# Altium schematic sheet MCU.SchDoc
size A3; SheetNumber: 4; SheetTotal: 5
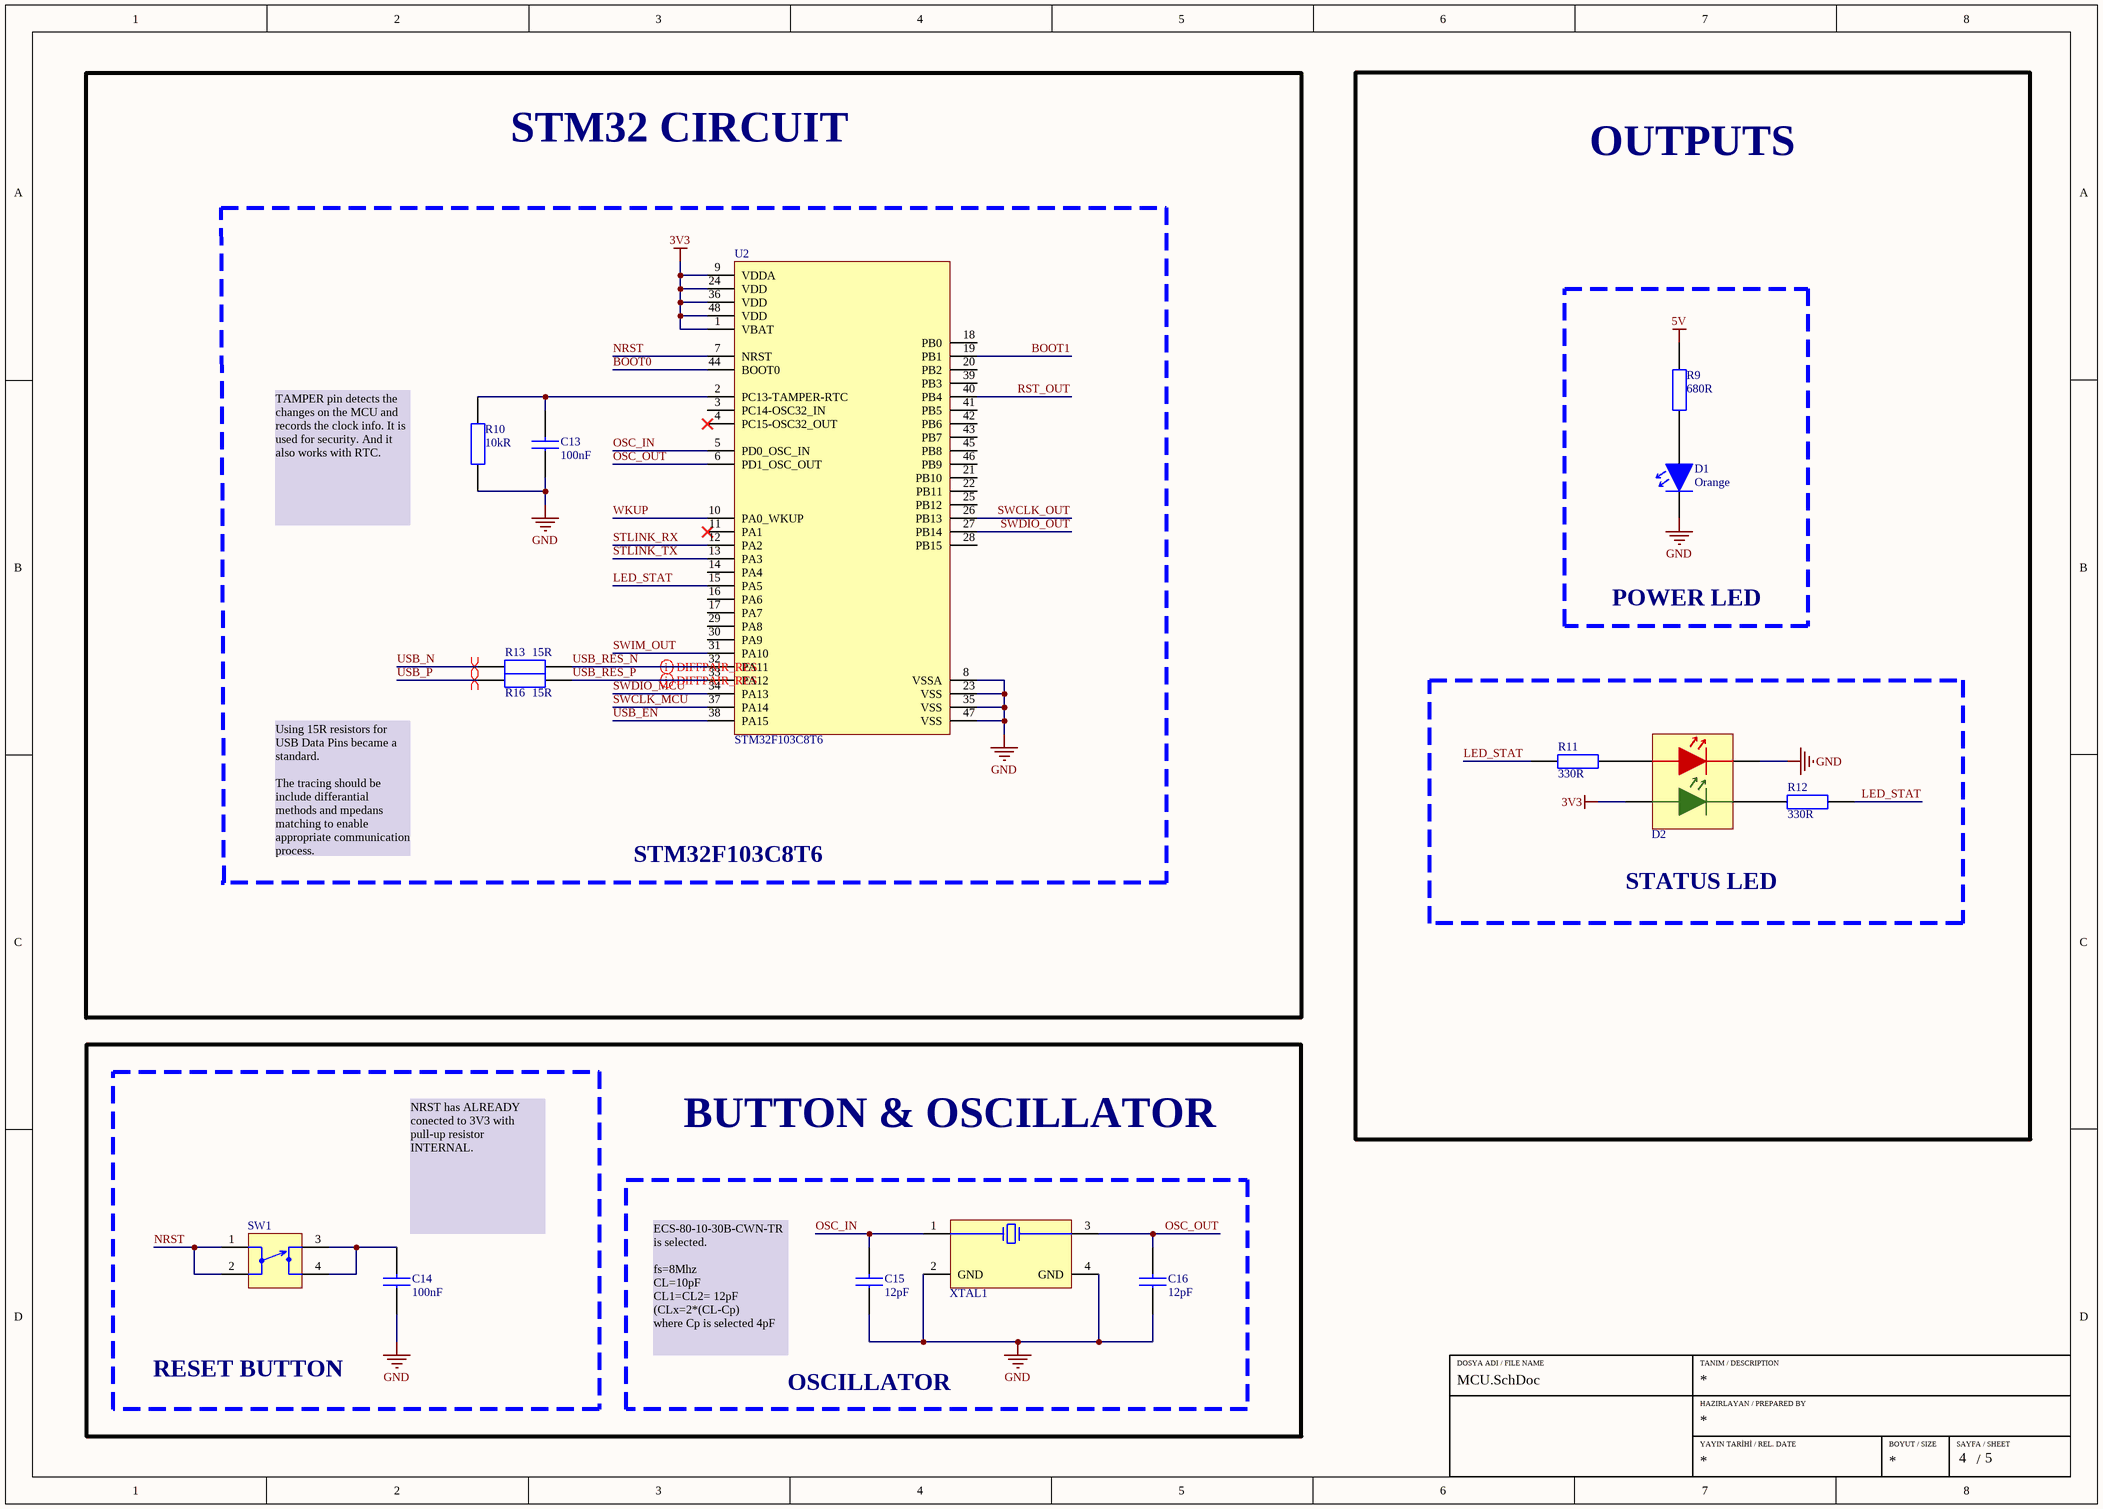
[diagram p0: MCU.SchDoc]

## Parts
C13  Capacitance: 100nF  [CAP_0603]  (hidden comment: C0603C104K5RACTU)
C14  Capacitance: 100nF  [CAP_0603]  (hidden comment: C0603C104K5RACTU)
C15  Capacitance: 12pF  [CAP_0603]  (hidden comment: CC0603FRNPO9BN120)
C16  Capacitance: 12pF  [CAP_0603]  (hidden comment: CC0603FRNPO9BN120)
D1  Illumination Color: Orange  [LED_ORANGE_0805]  (hidden comment: LTST-C170KFKT)
D2  APHB1608CGKSURKC  [LED_INDP_GREENRED_0603]  (value not drawn)
R9  Resistance: 680R  [RES_1206]  (hidden comment: RC1206FR-07680RL)
R10  Resistance: 10kR  [RES_0603]  (hidden comment: RC0603FR-0710KL)
R11  Resistance: 330R  [RES_0603]  (hidden comment: ERJ-H3EF3300V)
R12  Resistance: 330R  [RES_0603]  (hidden comment: ERJ-H3EF3300V)
R13  Resistance: 15R  [RES_0603]  (hidden comment: RC0603JR-0715RL)
R16  Resistance: 15R  [RES_0603]  (hidden comment: RC0603JR-0715RL)
SW1  PTS810 SJG 250 SMTR LFS  [BUTTON_SMD_BLUE]  (value not drawn)
U2  STM32F103C8T6  [LQFP48-STM]
XTAL1  ECS-80-10-30B-CWN-TR  [4-SMD, No Lead]  (value not drawn)

## Blocks framed on the sheet
STM32F103C8T6: C13 R10 R13 R16 U2
POWER LED: D1 R9
STATUS LED: D2 R11 R12
RESET BUTTON: C14 SW1
OSCILLATOR: C15 C16 XTAL1

## Nets
3V3: D2.1 U2.1(VBAT) U2.9(VDDA) U2.24(VDD) U2.36(VDD) U2.48(VDD)
5V: R9.1
GND: C13.1 C14.1 C15.1 C16.1 D1.1 D2.4 R10.1 U2.8(VSSA) U2.23(VSS) U2.35(VSS) U2.47(VSS) XTAL1.2(GND) XTAL1.4(GND)
BOOT0: U2.44(BOOT0)
BOOT1: U2.19(PB1)
LED_STAT: R11.1 R12.2 U2.15(PA5)
NRST: SW1.1 SW1.2 U2.7(NRST)
OSC_IN: C15.2 U2.5(PD0_OSC_IN) XTAL1.1
OSC_OUT: C16.2 U2.6(PD1_OSC_OUT) XTAL1.3
RST_OUT: U2.40(PB4)
STLINK_RX: U2.12(PA2)
STLINK_TX: U2.13(PA3)
SWCLK_MCU: U2.37(PA14)
SWCLK_OUT: U2.26(PB13)
SWDIO_MCU: U2.34(PA13)
SWDIO_OUT: U2.27(PB14)
SWIM_OUT: U2.31(PA10)
USB_EN: U2.38(PA15)
USB_N: R13.1
USB_P: R16.1
USB_RES_N: R13.2 U2.32(PA11)
USB_RES_P: R16.2 U2.33(PA12)
WKUP: U2.10(PA0_WKUP)
NetC13_2: C13.2 R10.2 U2.2(PC13-TAMPER-RTC)
NetC14_2: C14.2 SW1.3 SW1.4
NetD1_2: D1.2 R9.2
NetD2_2: D2.2 R12.1
NetD2_3: D2.3 R11.2

Not connected (* = marked no-connect by the designer): U2 3(PC14-OSC32_IN) 4(PC15-OSC32_OUT)* 11(PA1)* 14(PA4) 16(PA6) 17(PA7) 18(PB0) 20(PB2) 21(PB10) 22(PB11) 25(PB12) 28(PB15) 29(PA8) 30(PA9) 39(PB3) 41(PB5) 42(PB6) 43(PB7) 45(PB8) 46(PB9)

## Layout directives
differential pair: USB_N, USB_P, USB_RES_N, USB_RES_P

## Notes on the sheet
- STM32 CIRCUIT
- OUTPUTS
- TAMPER pin detects the changes on the MCU and records the clock info. It is used for security. And it also works with RTC.
- Using 15R resistors for USB Data Pins became a standard.
  The tracing should be include differantial methods and mpedans matching to enable appropriate communication process.
- BUTTON & OSCILLATOR
- (near C14) NRST has ALREADY conected to 3V3 with pull-up resistor INTERNAL.
- ECS-80-10-30B-CWN-TR is selected.
  fs=8Mhz
  CL=10pF
  CL1=CL2= 12pF
  (CLx=2*(CL-Cp)
  where Cp is selected 4pF
- DOSYA ADI / FILE NAME
- TANIM / DESCRIPTION
- HAZIRLAYAN / PREPARED BY
- YAYIN TARİHİ / REL. DATE
- BOYUT / SIZE
- SAYFA / SHEET
- /

## Library data of the parts
C13 C14 = CAP CER 100nF 0603: CAP CER 100nF %10 0603 SMD; Manufacturer: KEMET; DesignedBy: Aslı Kurt; Dielectric Material: Ceramic; Voltage Rating (DC): 50V; Tolerance: 10%; Dielectric: X7R; Dissipation Factor: 2.5%; Supplier 1: Digi-Key; Manufacturer Part Number: C0603C104K5RACTU; RoHS: Yes; Category: Ceramic Capacitors; Stock 1: 1666186; Pricing 1: 1=0,12000, 10=0,08500, 50=0,04620, 100=0,03770, 500=0,02696, 1000=0,02118 (USD); Mount: Surface Mount; Case/Package: 0603; Number of Pins: 2; Case Code (Metric): 1608; Case Code (Imperial): 0603; Contact Plating: Tin,Matte; Min Operating Temperature: -55°C; Max Operating Temperature: 125°C; Packaging: Tape and Reel; Package Quantity: 1; Termination: SMD/SMT; Voltage: 50V; Voltage Rating: 50V; Series: SMD Comm X7R; Length: 0.063inch; Width: 0.031inch; Height: 0.8mm; Thickness: 0.034inch; Lead Pitch: 0.7mm; Depth: 0.8mm; Radiation Hardening: No; RoHS Compliant: Yes; REACH SVHC: No SVHC; ComponentLink1URL: https://datasheet.ciiva.com/7823/kem-c1002-x7r-smd-7823591.pdf?src-supplier=Element14; ComponentLink1Description: https://datasheet.ciiva.com/7823/kem-c1002-x7r-smd-7823591.pdf?src-supplier=Element14; ComponentLink2URL: https://datasheet.ciiva.com/14602/70095383-14602583.pdf?src-supplier=Allied+Electronics; ComponentLink2Description: https://datasheet.ciiva.com/14602/70095383-14602583.pdf?src-supplier=Allied+Electronics; ComponentLink3URL: https://datasheet.ciiva.com/5999/kem-c1002-x7r-smd-5999400.pdf?src-supplier=Farnell; ComponentLink3Description: https://datasheet.ciiva.com/5999/kem-c1002-x7r-smd-5999400.pdf?src-supplier=Farnell; ComponentLink4URL: https://datasheet.ciiva.com/7823/kem-c1002-x7r-smd-7823592.pdf?src-supplier=Element14; ComponentLink4Description: https://datasheet.ciiva.com/7823/kem-c1002-x7r-smd-7823592.pdf?src-supplier=Element14; ComponentLink5URL: https://datasheet.ciiva.com/28645/1851736-28645640.pdf?src-supplier=Element14; ComponentLink5Description: https://datasheet.ciiva.com/28645/1851736-28645640.pdf?src-supplier=Element14; ComponentLink6URL: https://datasheet.ciiva.com/14585/70095383-14585209.pdf?src-supplier=Allied+Electronics; ComponentLink6Description: https://datasheet.ciiva.com/14585/70095383-14585209.pdf?src-supplier=Allied+Electronics; Supplier Part Number 1: 399-5089-1-ND
C15 C16 = CAP CER 12pF 0603: Multilayer Ceramic Capacitor, 12 pF, 50 V, ï¿½ 1%, C0G (NP0), 0603 [1608 Metric]; Manufacturer: Yageo; Voltage Rating: 50V; Voltage: 10V; Insulation Resistance: 10GR; DesignedBy: Aslı Kurt; Supplier 1: Future Electronics; Manufacturer Part Number: CC0603FRNPO9BN120; RoHS: Yes; Category: Ceramic Capacitors; Stock 1: 4000; Pricing 1: 4000=0,0152, 12000=0,0148, 20000=0,0147, 80000=0,0142, 120000=0,014 (USD); Mount: Surface Mount; Case/Package: 0603; Case Code (Imperial): 0603; Case Code (Metric): 1608; Min Operating Temperature: -55°C; Max Operating Temperature: 125°C; Tolerance: 1%; Dielectric: C0G; Packaging: Tape and Reel; Package Quantity: 4000; Voltage Rating (DC): 50V; Termination: SMD/SMT; Series: CC; Length: 1.6mm; Width: 0.031inch; Height: 0.8mm; Thickness: 0.035inch; Depth: 0.8mm; Radiation Hardening: No; Lead Free: Lead Free; RoHS Compliant: Yes; Halogen Free: 5694HalogenFree; ComponentLink1URL: https://datasheet.ciiva.com/13386/upy-gp-np0-16v-to-50v-8-13386294.pdf?src-supplier=Mouser; ComponentLink1Description: https://datasheet.ciiva.com/13386/upy-gp-np0-16v-to-50v-8-13386294.pdf?src-supplier=Mouser; Supplier 2: Arrow Electronics; Stock 2: 68000; Pricing 2: 4000=0,0162, 8000=0,016, 24000=0,0159, 48000=0,0157, 100000=0,0155 (USD); Supplier 3: Farnell; Stock 3: 16190; Pricing 3: 500=0,0393, 1000=0,0327, 2000=0,032 (EUR); Supplier 4: Mouser; Stock 4: 38219; Pricing 4: 1=0,18, 10=0,076, 50=0,076, 100=0,044, 1000=0,035, 10000=0,023 (USD); Supplier 5: Digikey; Stock 5: 15553; Pricing 5: 1=0,16, 10=0,089, 50=0,0622, 100=0,0539, 500=0,03984, 1000=0,03547 (USD); Supplier Part Number 1: 7517501; Supplier Part Number 2: CC0603FRNPO9BN120; Supplier Part Number 3: 3764409RL; Supplier Part Number 4: 603-C0603FRNPO9BN120; Supplier Part Number 5: 311-3885-1-ND
D1 = LED ORANGE 0805: LED Uni-Color Orange 611nm 2-Pin Chip LED T/R / LED ORANGE CLEAR 0805 SMD; Manufacturer: Vishay Lite-On; DesignedBy: Aslı Kurt; Lens Color: Colorless; Luminous Intensity: 60mcd; Forward Current: 30mA; Viewing Angle: 130°; Forward Voltage: 2V; Lens Style: Diffused,Colorless,Rectangular,Clear; Power Rating: 75mW; Dominant Wavelength: 605nm; Test Current: 20mA; Number of Elements: 1; Reverse Voltage: 5V; Supplier 1: Digikey; Manufacturer Part Number: LTST-C170KFKT; RoHS: Yes; Category: LEDs; Stock 1: 367568; Pricing 1: 1=0,23, 10=0,127, 100=0,0762, 500=0,05646, 1000=0,05041 (USD); Mount: Surface Mount; Case/Package: 0805; Number of Pins: 2; Color: Orange; Case Code (Metric): 2012; Case Code (Imperial): 0805; Min Operating Temperature: -55°C; Max Operating Temperature: 85°C; Packaging: Tape and Reel; Package Quantity: 1; Lens Transparency: Clear; Power Dissipation: 75mW; Wavelength: 611nm; Number of LEDs: 1; Length: 3.2mm; Width: 1.25mm; Height: 1.1mm; Depth: 1.6mm; Radiation Hardening: No; Lead Free: Lead Free; RoHS Compliant: Yes; ComponentLink1URL: https://datasheet.ciiva.com/12403/lite-on-ltst-c170kfkt-187690-12403821.pdf?src-supplier=Mouser; ComponentLink1Description: https://datasheet.ciiva.com/12403/lite-on-ltst-c170kfkt-187690-12403821.pdf?src-supplier=Mouser; ComponentLink2URL: https://datasheet.ciiva.com/11773/0900766b80dc0279-11773662.pdf?src-supplier=Rs; ComponentLink2Description: https://datasheet.ciiva.com/11773/0900766b80dc0279-11773662.pdf?src-supplier=Rs; ComponentLink3URL: https://datasheet.ciiva.com/15117/getdatasheetpartid-158266-15117926.pdf?src-supplier=Verical; ComponentLink3Description: https://datasheet.ciiva.com/15117/getdatasheetpartid-158266-15117926.pdf?src-supplier=Verical; ComponentLink4URL: https://datasheet.ciiva.com/16427/ltst-c170kfkt-16427484.pdf?src-supplier=Future+Electronics; ComponentLink4Description: https://datasheet.ciiva.com/16427/ltst-c170kfkt-16427484.pdf?src-supplier=Future+Electronics; ComponentLink5URL: https://datasheet.ciiva.com/2110/s-110-ltst-c170kfkt-2110076.pdf?src-supplier=Digikey; ComponentLink5Description: https://datasheet.ciiva.com/2110/s-110-ltst-c170kfkt-2110076.pdf?src-supplier=Digikey; ComponentLink6URL: https://datasheet.ciiva.com/2110/s-110-ltst-c170kfkt-2110075.pdf?src-supplier=Digikey; ComponentLink6Description: https://datasheet.ciiva.com/2110/s-110-ltst-c170kfkt-2110075.pdf?src-supplier=Digikey; ComponentLink7URL: https://datasheet.ciiva.com/2110/s-110-ltst-c170kfkt-2110077.pdf?src-supplier=Digikey; ComponentLink7Description: https://datasheet.ciiva.com/2110/s-110-ltst-c170kfkt-2110077.pdf?src-supplier=Digikey; Supplier Part Number 1: 160-1413-1-ND
D2 = LED_INDP_GREENRED_0603: Green/Red 0603 130° Clear 50/250 mcd 2.1/1.95 V Surface Mount Flat Top LED; Manufacturer: Kingbright; DesginedBy: Aslı Kurt; Wavelength: 570nm; Supplier 1: Future Electronics; Manufacturer Part Number: APHB1608CGKSURKC; RoHS: No; Category: LEDs; Stock 1: 22000; Pricing 1: 2000=0,11, 4000=0,107, 6000=0,105, 10000=0,103, 20000=0,0988 (USD); Lead Free: 5697LeadFree; ComponentLink1URL: https://datasheet.ciiva.com/4688/aphb1608cgksurkc-39721-4688241.pdf?src-supplier=Mouser; ComponentLink1Description: https://datasheet.ciiva.com/4688/aphb1608cgksurkc-39721-4688241.pdf?src-supplier=Mouser; ComponentLink2URL: https://datasheet.ciiva.com/2121/aphb1608cgksurkc-2121286.pdf?src-supplier=Digikey; ComponentLink2Description: https://datasheet.ciiva.com/2121/aphb1608cgksurkc-2121286.pdf?src-supplier=Digikey; Supplier 2: Mouser; Stock 2: 32899; Pricing 2: 1=0,48, 10=0,303, 50=0,303, 100=0,175, 1000=0,137, 10000=0,099 (USD); Supplier 3: Digikey; Stock 3: 21739; Pricing 3: 1=0,49, 10=0,303, 100=0,1742, 1000=0,13635 (USD); Supplier 4: Digikey; Stock 4: 21739; Pricing 4: 1=0,49, 10=0,303, 100=0,1742, 1000=0,13635 (USD); Supplier 5: Arrow Electronics; Stock 5: 265438; Pricing 5: 613=0,163, 1000=0,1269, 2000=0,097, 10000=0,0952 (USD); Supplier Part Number 1: 8000491; Supplier Part Number 2: 604-APHB1608CGKSURKC; Supplier Part Number 3: 754-2165-6-ND; Supplier Part Number 4: 754-2165-1-ND; Supplier Part Number 5: APHB1608CGKSURKC
R9 = RES 680 OHM 1206: SMD Chip Resistor, 680 Ohm, ï¿½ 1%, 250 mW, 1206 [3216 Metric], Thick Film, General Purpose; Manufacturer: Yageo; Voltage Rating (AC): 200V; DesignedBy: Aslı Kurt; Supplier 1: Future Electronics; Manufacturer Part Number: RC1206FR-07680RL; RoHS: Yes; Category: Chip SMD Resistors; Stock 1: 315000; Pricing 1: 5000=0,0057, 20000=0,0055, 75000=0,0052, 200000=0,0051, 500000=0,0049 (USD); Lead Free: 5697LeadFree; ComponentLink1URL: https://datasheet.ciiva.com/11819/0900766b80c6630a-11819964.pdf?src-supplier=Rs; ComponentLink1Description: https://datasheet.ciiva.com/11819/0900766b80c6630a-11819964.pdf?src-supplier=Rs; ComponentLink2URL: https://datasheet.ciiva.com/7857/444357-7857386.pdf?src-supplier=Element14; ComponentLink2Description: https://datasheet.ciiva.com/7857/444357-7857386.pdf?src-supplier=Element14; ComponentLink3URL: https://datasheet.ciiva.com/7857/1686128-7857387.pdf?src-supplier=Element14; ComponentLink3Description: https://datasheet.ciiva.com/7857/1686128-7857387.pdf?src-supplier=Element14; ComponentLink4URL: https://datasheet.ciiva.com/7857/444357-7857388.pdf?src-supplier=Element14; ComponentLink4Description: https://datasheet.ciiva.com/7857/444357-7857388.pdf?src-supplier=Element14; ComponentLink5URL: https://datasheet.ciiva.com/46445/444357-46445718.pdf?src-supplier=Element14; ComponentLink5Description: https://datasheet.ciiva.com/46445/444357-46445718.pdf?src-supplier=Element14; ComponentLink6URL: https://datasheet.ciiva.com/17422/pyu-rc1206-51-rohs-l-4-17422460.pdf?src-supplier=Future+Electronics; ComponentLink6Description: https://datasheet.ciiva.com/17422/pyu-rc1206-51-rohs-l-4-17422460.pdf?src-supplier=Future+Electronics; Supplier 2: Rs; Stock 2: 2900; Pricing 2: 100=0,012, 1000=0,007, 2500=0,005, 5000=0,005, 10000=0,005 (GBP); Supplier 3: Avnet; Stock 3: 8860; Pricing 3: 1=0,104, 25=0,026, 50=0,021, 100=0,016 (USD); Supplier 4: Arrow Electronics; Stock 4: 830000; Pricing 4: 5000=0,0058, 10000=0,005, 25000=0,005, 50000=0,0037, 125000=0,0036 (USD); Supplier 5: Digikey; Stock 5: 2188492; Pricing 5: 1=0,1, 10=0,026, 50=0,0204, 100=0,0153, 500=0,01276, 1000=0,0102 (USD); Supplier 6: Mouser; Stock 6: 54929; Pricing 6: 1=0,1, 10=0,018, 50=0,018, 100=0,015, 1000=0,009, 10000=0,005 (USD); Supplier Part Number 1: 8645095; Supplier Part Number 6: 603-RC1206FR-07680RL; Supplier Part Number 2: 1988442; Supplier Part Number 3: 49AK3834; Supplier Part Number 4: RC1206FR-07680RL; Supplier Part Number 5: 311-680FRCT-ND
R10 = RES 10K OHM 0603: RES 10K %1 OHM 0603 SMD; Manufacturer: Yageo; DesignedBy: Aslı Kurt; Tolerance: 1%; Temperature Coefficient: 100ppm/°C; Voltage Rating (DC): 50V; Power Rating: 100mW; Voltage Rating: 75V; Supplier 1: Digi-Key; Manufacturer Part Number: RC0603FR-0710KL; RoHS: Yes; Category: Chip SMD Resistors; Stock 1: 24140601; Pricing 1: 1=0,10000, 10=0,02300, 100=0,00930, 1000=0,00417, 2500=0,00362 (USD); Case/Package: 0603; Number of Pins: 2; Case Code (Imperial): 0603; Case Code (Metric): 1608; Weight: 7.1E-05oz; Size Code: 0603; Min Operating Temperature: -55°C; Max Operating Temperature: 155°C; Resistor Type: Thick Film; Packaging: Tape and Reel; Termination: SMD/SMT; Features: Moisture Resistant; Series: RC; Max Power Dissipation: 100mW; Number of Terminations: 2; Resistance Tolerance: 1%; Construction: Rectangular; Length: 1.6mm; Width: 0.8mm; Height: 0.45mm; Depth: 0.8mm; Lead Pitch: 0.3mm; REACH SVHC: Unknown; Lead Free: Lead Free; Military Standard: Not; RoHS Compliant: Yes; ComponentLink1URL: https://datasheet.ciiva.com/7660/38590-7660789.pdf?src-supplier=Element14; ComponentLink1Description: https://datasheet.ciiva.com/7660/38590-7660789.pdf?src-supplier=Element14; ComponentLink2URL: https://datasheet.ciiva.com/15189/getdatasheetpartid-409289-15189591.pdf?src-supplier=Verical; ComponentLink2Description: https://datasheet.ciiva.com/15189/getdatasheetpartid-409289-15189591.pdf?src-supplier=Verical; ComponentLink3URL: https://datasheet.ciiva.com/46440/1868787-46440891.pdf?src-supplier=Element14; ComponentLink3Description: https://datasheet.ciiva.com/46440/1868787-46440891.pdf?src-supplier=Element14; ComponentLink4URL: https://datasheet.ciiva.com/7983/443971-7983596.pdf?src-supplier=Element14; ComponentLink4Description: https://datasheet.ciiva.com/7983/443971-7983596.pdf?src-supplier=Element14; ComponentLink5URL: https://datasheet.ciiva.com/7746/1738695-7746239.pdf?src-supplier=Element14; ComponentLink5Description: https://datasheet.ciiva.com/7746/1738695-7746239.pdf?src-supplier=Element14; ComponentLink6URL: https://datasheet.ciiva.com/22747/443971-22747519.pdf?src-supplier=Element14; ComponentLink6Description: https://datasheet.ciiva.com/22747/443971-22747519.pdf?src-supplier=Element14; Supplier Part Number 1: 311-10.0KHRCT-ND
R11 R12 = RES 330 OHM 0603: RES, 330R, 1%, 0.125W, 0603;; Manufacturer: Panasonic; DesignedBy: Aslı Kurt; Supplier 1: Mouser; Manufacturer Part Number: ERJ-H3EF3300V; RoHS: Yes; Category: Chip SMD Resistors; Stock 1: 10551; Pricing 1: 1=0,23, 10=0,078, 50=0,078, 100=0,048, 1000=0,039, 10000=0,032 (USD); ComponentLink1URL: https://datasheet.octopart.com/ERJH3EF3300V-Panasonic-datasheet-165581513.pdf?src-supplier=TME; ComponentLink1Description: https://datasheet.octopart.com/ERJH3EF3300V-Panasonic-datasheet-165581513.pdf?src-supplier=TME; Supplier 2: Rs; Stock 2: 4600; Pricing 2: 100=0,014, 1000=0,018, 2500=0,017 (GBP); Supplier 3: Farnell; Stock 3: 590; Pricing 3: 10=0,0834, 100=0,0499, 500=0,0409, 1000=0,0318, 2500=0,0276, 5000=0,0234, 25000=0,0215, 50000=0,0196 (EUR); Supplier 4: Farnell; Stock 4: 590; Pricing 4: 500=0,0409, 1000=0,0318, 2500=0,0276, 5000=0,0234, 25000=0,0215, 50000=0,0196 (EUR); Supplier 5: Digikey; Stock 5: 8987; Pricing 5: 1=0,21, 10=0,104, 50=0,0698, 100=0,0597, 500=0,04328, 1000=0,03835 (USD); Supplier Part Number 1: 667-ERJ-H3EF3300V; Supplier Part Number 2: 2276644; Supplier Part Number 3: 3645156; Supplier Part Number 4: 3645156RL; Supplier Part Number 5: 10-ERJ-H3EF3300VCT-ND
R13 R16 = RES 15 OHM 0603: RES 15 %5 OHM 0603 SMD; Manufacturer: Yageo; Tolerance: 5%; Temperature Coefficient: 100ppm/°C; Voltage Rating (DC): 50V; Power Rating: 100mW; Voltage Rating: 75V; DesignedBy: Aslı Kurt; Supplier 1: Digi-Key; Manufacturer Part Number: RC0603JR-0715RL; RoHS: Yes; Category: Chip SMD Resistors; Stock 1: 1720; Pricing 1: 1=0,10000, 10=0,01900, 100=0,00770, 1000=0,00344, 2500=0,00298 (USD); Case/Package: 0603; Number of Pins: 2; Case Code (Imperial): 0603; Case Code (Metric): 1608; Weight: 7.1E-05oz; Min Operating Temperature: -55°C; Max Operating Temperature: 155°C; Resistor Type: Thick Film; Packaging: Tape and Reel; Package Quantity: 1; Termination: SMD/SMT; Number of Terminations: 2; Max Power Dissipation: 100mW; Working Voltage: 75V; Features: Moisture Resistant; Series: RC; Resistance Tolerance: 5%; Construction: Rectangular; Length: 1.6mm; Width: 0.8mm; Height: 0.022inch; Depth: 0.8mm; REACH SVHC: No SVHC; Lead Free: Lead Free; Military Standard: Not; RoHS Compliant: Yes; ComponentLink1URL: https://datasheet.ciiva.com/2453/pyu-r-int-thick-7-2453085.pdf?src-supplier=Digi-Key; ComponentLink1Description: https://datasheet.ciiva.com/2453/pyu-r-int-thick-7-2453085.pdf?src-supplier=Digi-Key; ComponentLink2URL: https://datasheet.ciiva.com/7746/443971-7746445.pdf?src-supplier=Element14; ComponentLink2Description: https://datasheet.ciiva.com/7746/443971-7746445.pdf?src-supplier=Element14; ComponentLink3URL: https://datasheet.ciiva.com/2453/pyu-r-int-thick-7-2453086.pdf?src-supplier=Digi-Key; ComponentLink3Description: https://datasheet.ciiva.com/2453/pyu-r-int-thick-7-2453086.pdf?src-supplier=Digi-Key; ComponentLink4URL: https://datasheet.ciiva.com/7746/443971-7746446.pdf?src-supplier=Element14; ComponentLink4Description: https://datasheet.ciiva.com/7746/443971-7746446.pdf?src-supplier=Element14; ComponentLink5URL: https://datasheet.ciiva.com/2453/pyu-r-int-thick-7-2453087.pdf?src-supplier=Digi-Key; ComponentLink5Description: https://datasheet.ciiva.com/2453/pyu-r-int-thick-7-2453087.pdf?src-supplier=Digi-Key; Supplier Part Number 1: 311-15GRCT-ND
SW1 = PTS810 SJG 250 SMTR LFS: Switch Tactile N.O. SPST Button J-Bend 0.05A 16VDC 100000Cycles 3.92N SMD T/R; Manufacturer: ITT C&K; DesignedBy: Aslı Kurt; Contact Resistance: 500mR; Number of Positions: 2NUMBER; Supplier 1: Arrow Electronics; Manufacturer Part Number: PTS810SJG250SMTRLFS; RoHS: Yes; Category: Tactile Switches; Stock 1: 14500; Pricing 1: 2900=0,3356, 5800=0,3138, 8700=0,3015, 14500=0,2865, 20300=0,2771, 29000=0,2673 (USD); Lead Free: 5697LeadFree; ComponentLink1URL: https://datasheet.ciiva.com/18514/pts810-4mar13-18514165.pdf?src-supplier=Digikey; ComponentLink1Description: https://datasheet.ciiva.com/18514/pts810-4mar13-18514165.pdf?src-supplier=Digikey; ComponentLink2URL: https://datasheet.ciiva.com/18514/pts810-4mar13-18514166.pdf?src-supplier=Digikey; ComponentLink2Description: https://datasheet.ciiva.com/18514/pts810-4mar13-18514166.pdf?src-supplier=Digikey; ComponentLink3URL: https://datasheet.ciiva.com/18514/pts810-4mar13-18514167.pdf?src-supplier=Digikey; ComponentLink3Description: https://datasheet.ciiva.com/18514/pts810-4mar13-18514167.pdf?src-supplier=Digikey; Supplier 2: Mouser; Stock 2: 5429; Pricing 2: 1=0,54, 10=0,505, 50=0,505, 100=0,406, 1000=0,333, 10000=0,265 (USD); Supplier 3: Digikey; Stock 3: 69769; Pricing 3: 1=0,65, 10=0,526, 25=0,4844, 100=0,4267, 250=0,39208, 500=0,36752, 1000=0,34425 (USD); Supplier 4: Digikey; Stock 4: 63800; Pricing 4: 2900=0,3109, 5800=0,29064, 8700=0,27928, 14500=0,26548, 20300=0,25668, 29000=0,2476 (USD); Supplier Part Number 1: PTS810SJG250SMTRLFS; Supplier Part Number 2: 611-PTS810SJG250SMTR; Supplier Part Number 3: CKN10504DKR-ND; Supplier Part Number 4: CKN10504TR-ND
U2 = STM32F103C8T6: ARM Cortex-M3 STM32 F1 Microcontroller 32-Bit 72MHz 64kB FLASH LQFP48 STM32F103C8T6; Manufacturer: STMicroelectronics; RAM Size: 20KB; Interface: I2C,SPI,USB,CAN,USART; Number of I/Os: 37; Number of Timers/Counters: 3; Max Supply Voltage: 3.6V; Number of ADC Channels: 10; Min Supply Voltage: 2V; Data Bus Width: 32b; Nominal Supply Current: 1.7uA; Number of A/D Converters: 2NUMBER; Number of Channels: 10NUMBER; DesignedBy: Aslı Kurt; Supplier 1: Future Electronics; Manufacturer Part Number: STM32F103C8T6; RoHS: Yes; Category: Microcontrollers; Stock 1: 12000; Pricing 1: 250=3,45, 500=3,39, 750=3,36, 1000=3,34, 1250=3,27 (USD); Case/Package: LQFP; Number of Pins: 48; Weight: 0.006349oz; Min Operating Temperature: -40°C; Max Operating Temperature: 85°C; Packaging: Tray; Package Quantity: 1500; Memory Type: FLASH; Max Frequency: 72MHz; Memory Size: 64KB; Core Architecture: ARM; Series: STM32F103C8; Length: 7mm; Width: 7mm; Height: 1.4mm; Lead Free: Lead Free; RoHS Compliant: Yes; ComponentLink1URL: https://datasheet.ciiva.com/15122/getdatasheetpartid-69880-15122076.pdf?src-supplier=Verical; ComponentLink1Description: https://datasheet.ciiva.com/15122/getdatasheetpartid-69880-15122076.pdf?src-supplier=Verical; ComponentLink2URL: https://datasheet.ciiva.com/8054/1730126-8054942.pdf?src-supplier=Element14; ComponentLink2Description: https://datasheet.ciiva.com/8054/1730126-8054942.pdf?src-supplier=Element14; ComponentLink3URL: https://datasheet.ciiva.com/14100/pustm-arm-microcont-stm32f103-en-14100508.pdf?src-supplier=Distrelec; ComponentLink3Description: https://datasheet.ciiva.com/14100/pustm-arm-microcont-stm32f103-en-14100508.pdf?src-supplier=Distrelec; ComponentLink4URL: https://datasheet.ciiva.com/16210/cd00161566-16210248.pdf?src-supplier=Future+Electronics; ComponentLink4Description: https://datasheet.ciiva.com/16210/cd00161566-16210248.pdf?src-supplier=Future+Electronics; ComponentLink5URL: https://datasheet.ciiva.com/48687/001075658-da-01-en-mcu-64kb-mem-stm32f103c8t6-lqfp-48-stm-48687589.pdf?src-supplier=Conrad; ComponentLink5Description: https://datasheet.ciiva.com/48687/001075658-da-01-en-mcu-64kb-mem-stm32f103c8t6-lqfp-48-stm-48687589.pdf?src-supplier=Conrad; Supplier 2: Future Electronics; Stock 2: 8204; Pricing 2: 250=2,63 (USD); Supplier 3: Mouser; Stock 3: 11174; Pricing 3: 1=5,61, 10=5,11, 50=4,3, 100=4,29, 1000=3,47, 10000=3,33 (USD); Supplier 4: Farnell; Stock 4: 68762; Pricing 4: 1=5,61, 10=4,64, 25=3,94, 50=3,93, 100=3,92, 250=3,76, 500=3,47 (EUR); Supplier 5: Arrow Electronics; Stock 5: 1132418; Pricing 5: 1=3,7887, 10=3,5549, 25=3,1592, 50=3,139, 100=3,1122, 250=2,9509, 500=2,6084 (USD); Supplier 6: Digikey; Stock 6: 9084; Pricing 6: 1=6,11, 10=5,522, 25=5,2652, 80=4,57163, 250=4,36616, 500=3,9809, 1000=3,46724, 2500=3,33883 (USD); Supplier Part Number 1: 7957939; Supplier Part Number 2: 6124222; Supplier Part Number 3: 511-STM32F103C8T6; Supplier Part Number 4: 1447637; Supplier Part Number 5: STM32F103C8T6; Supplier Part Number 6: 497-6063-ND
XTAL1 = ECS-80-10-30B-CWN-TR: Crystal 8MHz ±10ppm (Tol) ±15ppm (Stability) 10pF FUND 100Ohm 4-Pin Mini-SMD T/R; Manufacturer: ECS International; DesignedBy: Aslı Kurt; Supplier 1: Avnet; Manufacturer Part Number: ECS-80-10-30B-CWN-TR; RoHS: Yes; Category: LDO; Stock 1: 2000; Pricing 1: 1000=0,28356 (USD); ComponentLink1URL: https://ecsxtal.com/store/pdf/ecx_53b.pdf?src-supplier=Digikey; ComponentLink1Description: https://ecsxtal.com/store/pdf/ecx_53b.pdf?src-supplier=Digikey; ComponentLink2URL: http://www.ecsxtal.com/store/pdf/ecx_53b.pdf?src-supplier=Digikey; ComponentLink2Description: http://www.ecsxtal.com/store/pdf/ecx_53b.pdf?src-supplier=Digikey; ComponentLink3URL: https://datasheet.octopart.com/ECS-80-10-30B-CWN-TR-ECS-International-datasheet-145012644.pdf?src-supplier=Master+Electronics; ComponentLink3Description: https://datasheet.octopart.com/ECS-80-10-30B-CWN-TR-ECS-International-datasheet-145012644.pdf?src-supplier=Master+Electronics; Supplier 2: Arrow Electronics; Stock 2: 7000; Pricing 2: 1000=0,3761, 2000=0,3659 (USD); Supplier 3: Farnell; Stock 3: 1351; Pricing 3: 100=0,445, 250=0,434, 500=0,423, 1000=0,405, 5000=0,387, 10000=0,369 (EUR); Supplier 4: Mouser; Stock 4: 6496; Pricing 4: 1=0,64, 10=0,52, 50=0,52, 100=0,497, 1000=0,396, 10000=0,366 (USD); Supplier 5: Digikey; Stock 5: 15344; Pricing 5: 1=0,68, 10=0,587, 50=0,5288, 100=0,5057, 500=0,45618 (USD); Supplier Part Number 1: ECS-80-10-30B-CWN-; Supplier Part Number 3: 4059249RL; Supplier Part Number 4: 520-80-10-30B-CWNT; Supplier Part Number 5: XC2708CT-ND; Supplier Part Number 2: ECS-80-10-30B-CWN-TR